# EAGLE design QMUAV Avionics PCB (EAGLE 9.6.2)
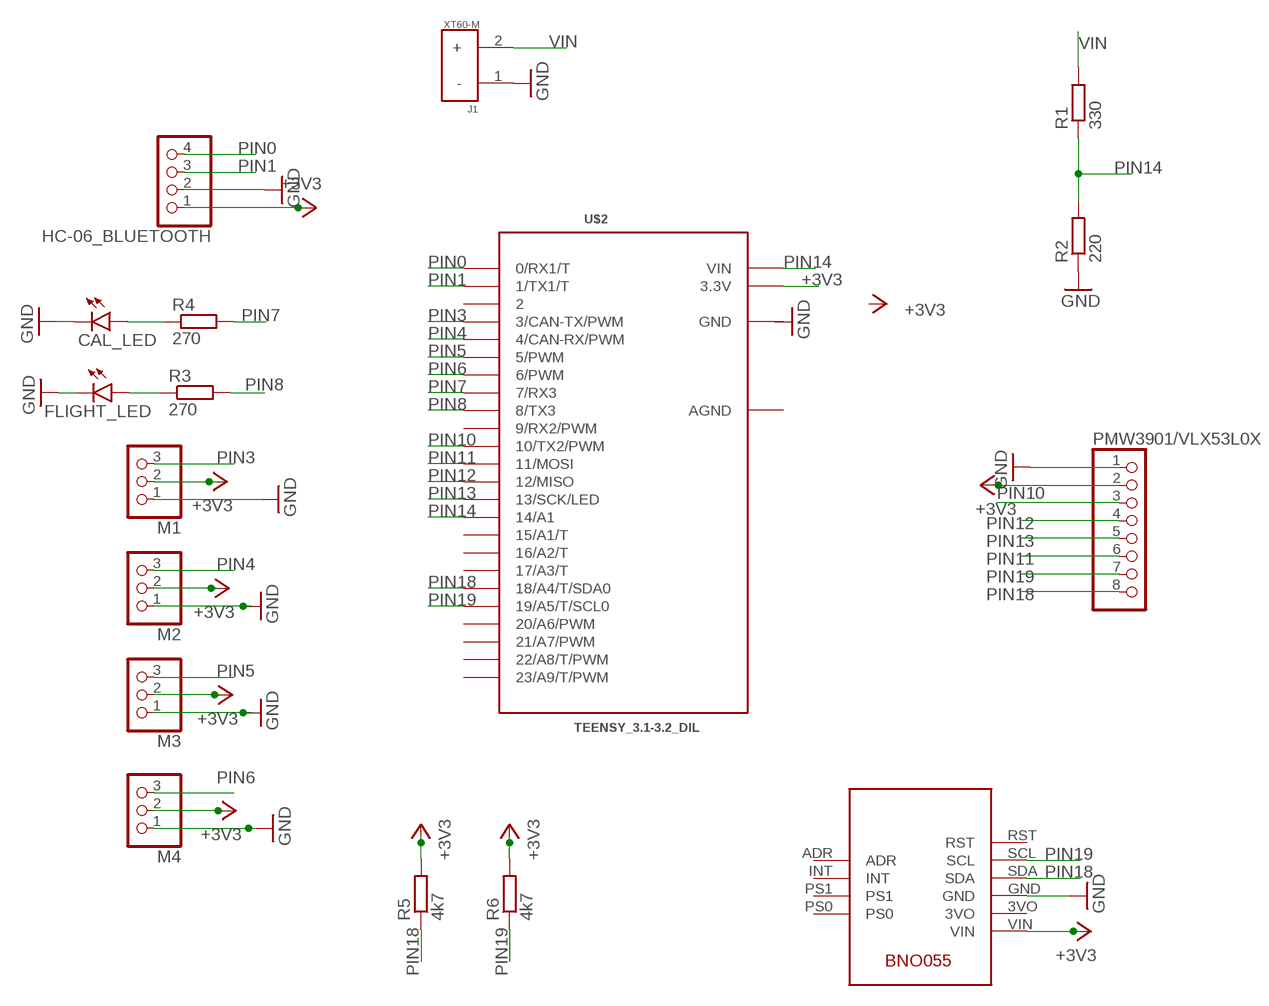
[diagram p0: schematic, sheet 1]

## Parts
CAL_LED  LED5MM  [LED5MM]
FLIGHT_LED  LED5MM  [LED5MM]
HC-06_BLUETOOTH  PINHD-1X4  [1X04]
J1  XT60-M  [AMASS_XT60-M]
M1  PINHD-1X3  [1X03]
M2  PINHD-1X3  [1X03]
M3  PINHD-1X3  [1X03]
M4  PINHD-1X3  [1X03]
PMW3901/VLX53L0X  PINHD-1X8  [1X08]
R1  330  R-EU_0207/10  [0207/10]
R2  220  R-EU_0207/10  [0207/10]
R3  270  R-EU_0207/10  [0207/10]
R4  270  R-EU_0207/10  [0207/10]
R5  4k7  R-EU_0207/10  [0207/10]
R6  4k7  R-EU_0207/10  [0207/10]
U$2  TEENSY_3.1-3.2_DIL  [TEENSY_3.0-3.2&LC_DIL]
U$3  BNO055  [BNO055]

## Nets
+3V3: HC-06_BLUETOOTH.1 M1.2 M2.2 M3.2 M4.2 PMW3901/VLX53L0X.2 R5.2 R6.2 U$2.3.3V U$3.VIN
GND: CAL_LED.K(C) FLIGHT_LED.K(C) HC-06_BLUETOOTH.2 J1.1(-) M1.1 M2.1 M3.1 M4.1 PMW3901/VLX53L0X.1 R2.1 U$3.GND
N$4: CAL_LED.A R4.1
N$5: FLIGHT_LED.A R3.1
PIN0: HC-06_BLUETOOTH.4 U$2.0(0/RX1/T)
PIN1: HC-06_BLUETOOTH.3 U$2.1(1/TX1/T)
PIN3: M1.3 U$2.3(3/CAN-TX/PWM)
PIN4: M2.3 U$2.4(4/CAN-RX/PWM)
PIN5: M3.3 U$2.5(5/PWM)
PIN6: M4.3 U$2.6(6/PWM)
PIN7: R4.2 U$2.7(7/RX3)
PIN8: R3.2 U$2.8(8/TX3)
PIN10: PMW3901/VLX53L0X.3 U$2.10(10/TX2/PWM)
PIN11: PMW3901/VLX53L0X.6 U$2.11(11/MOSI)
PIN12: PMW3901/VLX53L0X.4 U$2.12(12/MISO)
PIN13: PMW3901/VLX53L0X.5 U$2.13(13/SCK/LED)
PIN14: R1.1 R2.2 U$2.14/A0(14/A1) U$2.VIN
PIN18: PMW3901/VLX53L0X.8 R5.1 U$2.18/A4(18/A4/T/SDA0) U$3.SDA
PIN19: PMW3901/VLX53L0X.7 R6.1 U$2.19/A5(19/A5/T/SCL0) U$3.SCL
VIN: J1.2(+) R1.2
Unconnected: U$2.2 U$2.9(9/RX2/PWM) U$2.15/A1(15/A1/T) U$2.16/A2(16/A2/T) U$2.17/A3(17/A3/T) U$2.20/A6(20/A6/PWM) U$2.21/A7(21/A7/PWM) U$2.22/A8(22/A8/T/PWM) U$2.23/A9(23/A9/T/PWM) U$3.3VO U$3.ADR U$3.INT U$3.PS0 U$3.PS1 U$3.RST

## Power pins joined to a net without a drawn wire
AGND: U$2.AGND
GND: U$2.GND

## Library data of the parts
CAL_LED FLIGHT_LED = led:LED: LED OSRAM: - CHIPLED LG R971, LG N971, LY N971, LG Q971, LY Q971, LO R971, LY R971 LH N974, LH R974 LS Q976, LO Q976, LY Q976 LO Q996 - Hyper CHIPLED LW Q18S LB Q993, LB Q99A, LB R99A - SideLED LS A670, LO A670, LY A670, LG A670, LP A670 LB A673, LV A673, LT A673, LW A673 LH A674 LY A675 LS A676, LA A676, LO A676, LY A676, LW A676 LS A679, LY A679, LG A679 - Hyper Micro SIDELED® LS Y876, LA Y876, LO Y876, LY Y876 LT Y87S - SmartLED LW L88C, LW L88S LB L89C, LB L89S, LG L890 LS L89K, LO L89K, LY L89K LS L896, LA L896, LO L896, LY L896 - TOPLED LS T670, LO T670, LY T670, LG T670, LP T670 LSG T670, LSP T670, LSY T670, LOP T670, LYG T670 LG T671, LOG T671, LSG T671 LB T673, LV T673, LT T673, LW T673 LH T674 LS T676, LA T676, LO T676, LY T676, LB T676, LH T676, LSB T676, LW T676 LB T67C, LV T67C, LT T67C, LS T67K, LO T67K, LY T67K, LW E67C LS E67B, LA E67B, LO E67B, LY E67B, LB E67C, LV E67C, LT E67C LW T67C LS T679, LY T679, LG T679 LS T770, LO T770, LY T770, LG T770, LP T770 LB T773, LV T773, LT T773, LW T773 LH T774 LS E675, LA E675, LY E675, LS T675 LS T776, LA T776, LO T776, LY T776, LB T776 LHGB T686 LT T68C, LB T68C - Hyper Mini TOPLED® LB M676 - Mini TOPLED Santana® LG M470 LS M47K, LO M47K, LY M47K Source: http://www.osram.convergy.de LUXEON: - LUMILED® LXK2-PW12-R00, LXK2-PW12-S00, LXK2-PW14-U00, LXK2-PW14-V00 LXK2-PM12-R00, LXK2-PM12-S00, LXK2-PM14-U00 LXK2-PE12-Q00, LXK2-PE12-R00, LXK2-PE12-S00, LXK2-PE14-T00, LXK2-PE14-U00 LXK2-PB12-K00, LXK2-PB12-L00, LXK2-PB12-M00, LXK2-PB14-N00, LXK2-PB14-P00, LXK2-PB14-Q00 LXK2-PR12-L00, LXK2-PR12-M00, LXK2-PR14-Q00, LXK2-PR14-R00 LXK2-PD12-Q00, LXK2-PD12-R00, LXK2-PD12-S00 LXK2-PH12-R00, LXK2-PH12-S00 LXK2-PL12-P00, LXK2-PL12-Q00, LXK2-PL12-R00 Source: www.luxeon.com KINGBRIGHT: KA-3528ASYC Source: www.kingbright.com
HC-06_BLUETOOTH = pinhead:PINHD-1X4: PIN HEADER
J1 = XT60-M:XT60-M: DC supply; XT60; male; PIN:2; for cable; soldered; 60A; 500V; AVAILABILITY: Unavailable; DESCRIPTION: Plug; DC supply; XT60; male; PIN: 2; for cable; soldered; 30A; 500V; MF: AMASS; MP: XT60-M; PACKAGE: Package; PRICE: None
M1-M4 = pinhead:PINHD-1X3: PIN HEADER
PMW3901/VLX53L0X = pinhead:PINHD-1X8: PIN HEADER
R1-R6 = rcl:R-EU_: RESISTOR, European symbol; SPICEPREFIX: R
U$2 = Teensy_3_and_LC_Series_Boards_v1.4:TEENSY_3.1-3.2_DIL: Teensy 3.1 or 3.2 in a DIL Layout.
U$3 = ADAFRUIT BNO055:BNO055

## Board
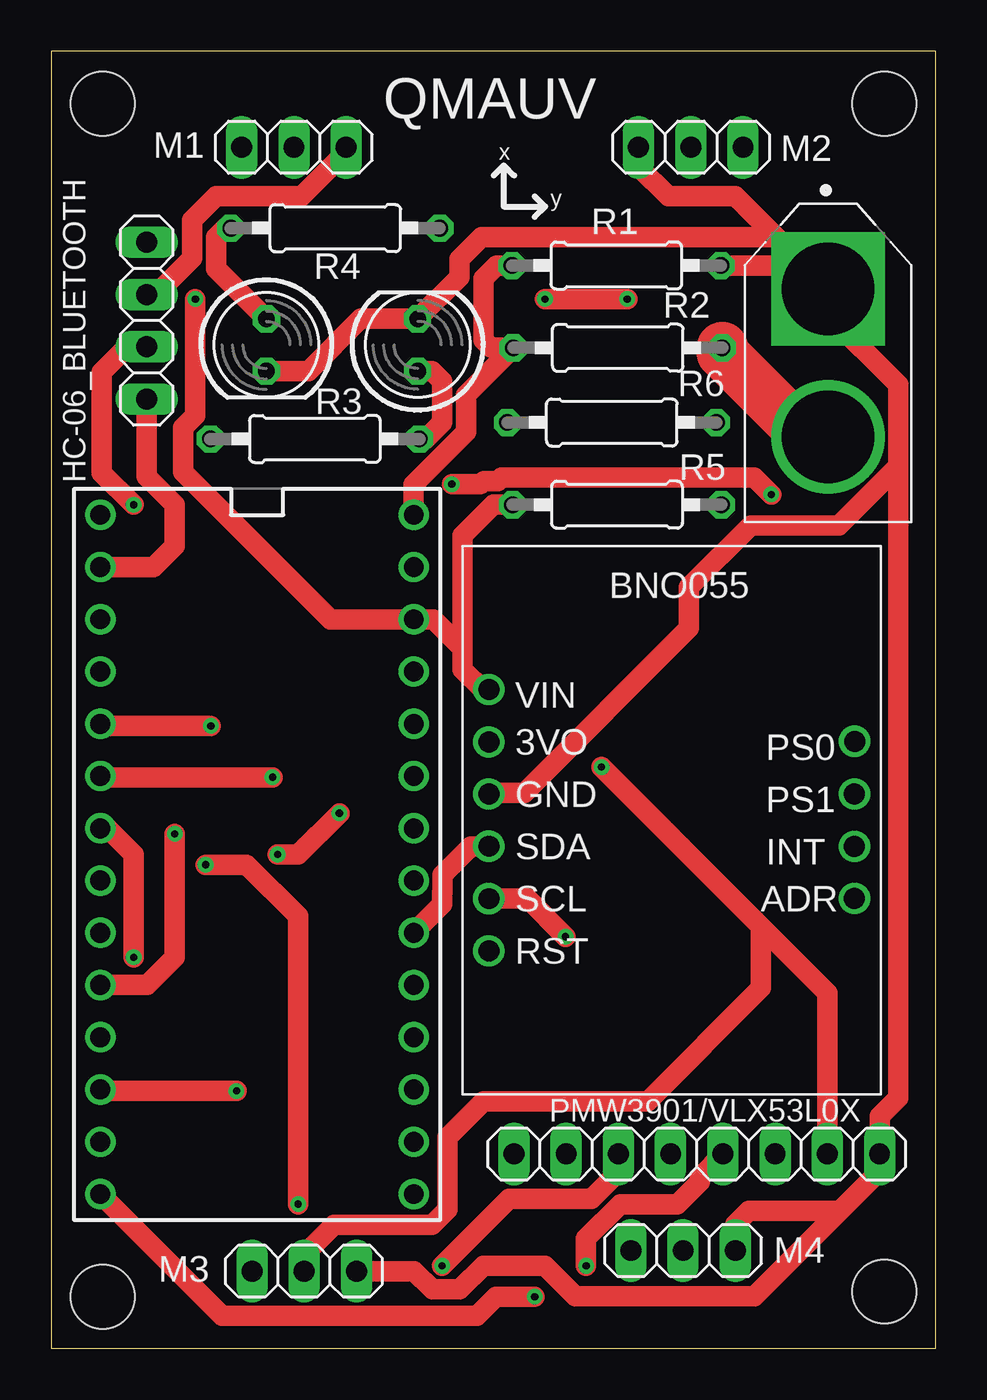
[diagram p1: board, top side]
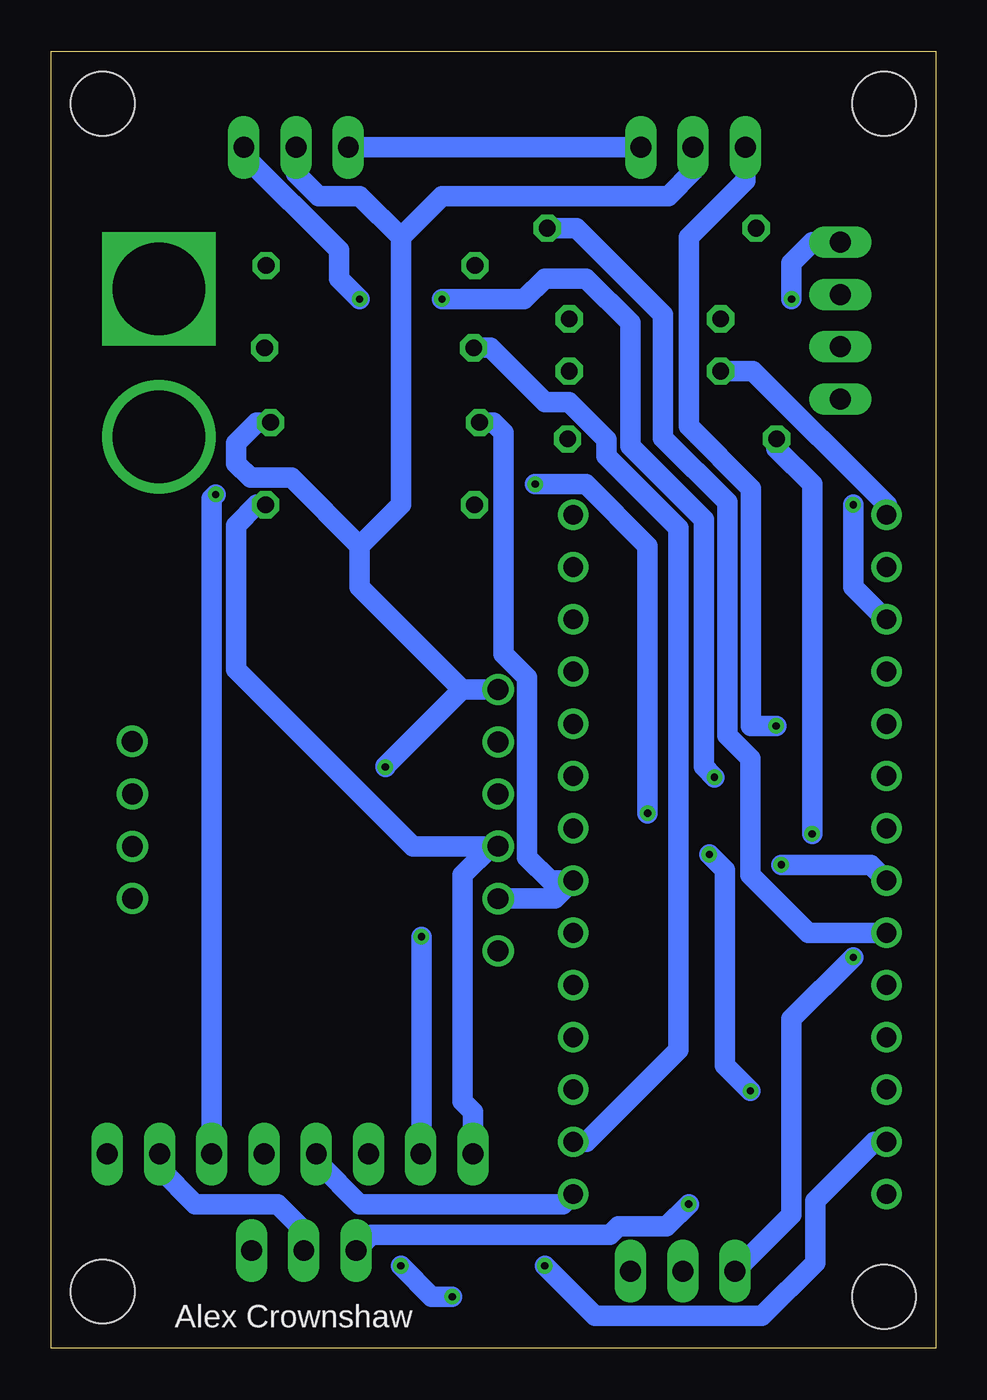
[diagram p2: board, bottom side, seen from below]

Size 42.99 x 63.04 mm. Coordinates in mm from the lower left corner, seen from the top.
Outline: 0,0 42.99,0 42.99,63.04 0,63.04 0,0
Copper layers (1*16): Top 0.035mm / dielectric 1.5mm / Bottom 0.035mm
Design rules "default": minimum track width 6mil, minimum drill 0.35mm, track to track 6mil, track to pad 6mil, pad to pad 6mil, via to via 6mil, smd to smd 6mil, copper to edge 40mil, drill to drill 6mil, minimum pad ring 10mil, minimum via ring 8mil, stop-mask expansion 4mil, vias tented up to drill 0mil, thermal gap 10mil
Holes 3.1 mm at 2.5,2.5 40.5,2.75 2.5,60.5 40.5,60.5

### Footprints (pad centres in the part's own frame; a part is rotated, then mirrored left to right if it is on the bottom)
LED5MM = drill 0.813 octagon: A -1.27,0; K 1.27,0
1X04 = drill 1.016 long: 1 -3.81,0; 2 -1.27,0; 3 1.27,0; 4 3.81,0
AMASS_XT60-M = drill 4.5 square: 1 -3.6,0 | drill 4.5: 2 3.6,0
1X03 = drill 1.016 long: 1 -2.54,0; 2 0,0; 3 2.54,0
1X08 = drill 1.016 long: 1 -8.89,0; 2 -6.35,0; 3 -3.81,0; 4 -1.27,0; 5 1.27,0; 6 3.81,0; 7 6.35,0; 8 8.89,0
0207/10 = drill 0.813 octagon: 1 -5.08,0; 2 5.08,0
TEENSY_3.0-3.2&LC_DIL = drill 0.965: 0 -7.62,13.97; 1 -7.62,11.43; 2 -7.62,8.89; 3 -7.62,6.35; 3.3V 7.62,11.43; 4 -7.62,3.81; 5 -7.62,1.27; 6 -7.62,-1.27; 7 -7.62,-3.81; 8 -7.62,-6.35; 9 -7.62,-8.89; 10 -7.62,-11.43; 11 -7.62,-13.97; 12 -7.62,-16.51; 13 7.62,-16.51; 14/A0 7.62,-13.97; 15/A1 7.62,-11.43; 16/A2 7.62,-8.89; 17/A3 7.62,-6.35; 18/A4 7.62,-3.81; 19/A5 7.62,-1.27; 20/A6 7.62,1.27; 21/A7 7.62,3.81; 22/A8 7.62,6.35; 23/A9 7.62,8.89; AGND 7.62,13.97; GND -7.62,16.51; VIN 7.62,16.51
BNO055 = drill 1.016: 3VO 9.53,1.27; ADR 17.14,19.05; GND 12.06,1.27; INT 14.61,19.05; PS0 9.5,19.06; PS1 12.06,19.05; RST 19.69,1.27; SCL 17.15,1.27; SDA 14.6,1.27; VIN 6.98,1.27

### Placement (x,y rotation side)
CAL_LED  10.45,48.77 270 top
FLIGHT_LED  17.81,48.77 90 top
HC-06_BLUETOOTH  4.63,49.95 270 top
J1  37.76,47.9 270 top
M1  11.79,58.38 180 top
M2  31.09,58.38 0 top
M3  12.29,3.74 180 top
M4  30.72,4.74 180 top
PMW3901/VLX53L0X  31.38,9.44 180 top
R1  27.54,48.63 0 top
R2  27.47,52.63 180 top
R3  12.81,44.2 180 top
R4  13.8,54.45 0 top
R5  27.5,41 180 top
R6  27.25,45 0 top
U$2  10,24 0 top
U$3  20,39 270 top

### Tracks (layer width: path | path; a pad name or v marks a point on that pad's centre or on a via)
+3V3  (via drill 0.35)
  Top 1: v7,51 7,45.33 6.42,44.74 6.42,42.58 13.57,35.43 U$2.3.3V 18.57,35.43 20,34 | v26.75,28.25 34.5,20.5 | 34.5,20.5 37.73,17.27 PMW3901/VLX53L0X.2 | 34.5,20.5 34.5,17.5 29,12 21,12 19.25,10.25 19.25,6.75 18.5,6 13.75,6 12.29,4.54 M3.2 | R5.2 21.5,41 20,39.5 20,34 | 20,34 20,33 20.98,32.02 U$3.VIN
  Bottom 1: HC-06_BLUETOOTH.1 5.99,53.76 7,52.75 v7,51 | U$3.VIN 23.02,32.02 | 23.02,32.02 28,37 28,39 | 28,39 26,41 26,54 | 26,54 24,56 13,56 11.79,57.21 M1.2 | 26,54 28,56 30,56 31.09,57.09 M2.2 | 28,39 31.31,42.31 33.31,42.31 34,43 34,44 33,45 R6.2 | 23.02,32.02 26.75,28.29 v26.75,28.25 | PMW3901/VLX53L0X.2 37.73,8.73 36,7 32,7 30.72,5.72 M4.2
GND
  Top 1: R2.1 36.62,52.63 | 36.62,52.63 J1.1 | J1.1 37.76,50.24 41.17,46.83 41.17,42.88 | 36.62,52.63 35.25,54 20.9,54 19.85,52.94 19.85,52.08 FLIGHT_LED.K 15.04,50.04 12.5,47.5 CAL_LED.K | M2.1 28.55,57.45 30,56 33.25,56 J1.1 | M1.1 14.33,58.16 12.17,56 8,56 6.85,54.85 6.85,53 5.07,51.22 HC-06_BLUETOOTH.2 | 41.17,42.88 41.17,12.17 40.27,11.27 PMW3901/VLX53L0X.1 40.27,8.61 38.33,6.67 | 38.33,6.67 34.18,2.52 25.48,2.52 24,4 21,4 19.85,2.85 18.52,2.85 17.63,3.74 M3.1 | 38.33,6.67 33.92,6.67 33.26,6.01 M4.1 | U$3.GND 21.33,27 23,27 31,35 31,37 34,40 38.28,40 41.17,42.88
  Bottom 1: M1.1 M2.1 | U$2.GND 2.38,41.01 8.87,47.5 CAL_LED.K
N$4
  Top 1: R4.1 8.45,54.45 8,54 8,52.49 CAL_LED.A
N$5
  Top 1: R3.1 18.2,44.2 19,45 19,47 18.5,47.5 FLIGHT_LED.A
PIN0
  Top 1: HC-06_BLUETOOTH.4 4.63,42.37 6,41 6,39 4.97,37.97 U$2.0
PIN1  (via drill 0.35)
  Top 1: HC-06_BLUETOOTH.3 3.68,48.68 2.45,47.45 2.45,42.55 v4,41
  Bottom 1: U$2.1 2.43,35.43 4,37 v4,41
PIN3  (via drill 0.35)
  Top 1: v7.75,30.25 2.48,30.25 U$2.3
  Bottom 1: M1.3 9.25,56.75 12,54 12,44.83 8.97,41.8 8.97,30.25 v7.75,30.25
PIN4  (via drill 0.35)
  Top 1: v28,51 v24,51 | v10.75,27.75 2.44,27.75 U$2.4
  Bottom 1: v28,51 29,52 29,53.37 33.63,58 M2.3 | v24,51 20,51 19,52 17,52 14.85,49.85 14.85,43.85 11.27,40.27 11.27,28.27 v10.75,27.75
PIN5  (via drill 0.35)
  Top 1: v4,19 4,24 2.73,25.27 U$2.5
  Bottom 1: M3.3 7,6.49 7,16 v4,19
PIN6  (via drill 0.35)
  Top 1: v7.5,23.5 9.5,23.5 12,21 v12,7
  Bottom 1: v12,7 13.08,5.92 15.42,5.92 15.83,5.5 27.42,5.5 M4.3 | v7.5,23.5 3.15,23.5 U$2.6
PIN7
  Bottom 1: R4.2 17.45,54.45 13.25,50.25 13.25,44.25 10.12,41.12 10.12,29.77 9,28.65 9,23 6.19,20.19 U$2.7
PIN8  (via drill 0.35)
  Top 1: v6,25 6,19 4.65,17.65 U$2.8
  Bottom 1: R3.2 7.73,43.73 6,42 v6,25
PIN10  (via drill 0.35)
  Top 1: v35,41.5 34.19,42.31 21.88,42.31 21.72,42.15 21.02,42.15 20.87,42 v19.47,42 | v14,26 12,24 v11,24 | v9,12.5 2.45,12.5 U$2.10
  Bottom 1: PMW3901/VLX53L0X.3 35.19,41.31 v35,41.5 | v19.47,42 17,42 14,39 v14,26 | v11,24 10.25,23.25 10.25,13.75 v9,12.5
PIN11  (via drill 0.35)
  Top 1: PMW3901/VLX53L0X.6 27.57,8.57 26.25,7.25 22.25,7.25 v19,4
  Bottom 1: v19,4 16.56,1.56 8.44,1.56 5.85,4.15 5.85,7.15 2.97,10.03 U$2.11
PIN12  (via drill 0.35)
  Top 1: PMW3901/VLX53L0X.4 31.52,8.31 31.52,8.09 30.43,7 27.67,7 26,5.33 v26,4 | v23.5,2.5 21.63,2.5 20.69,1.56 8.31,1.56 U$2.12
  Bottom 1: v26,4 24.5,2.5 v23.5,2.5
PIN13
  Bottom 1: PMW3901/VLX53L0X.5 30,9.33 30,9 28,7 18.11,7 U$2.13
PIN14
  Top 1: R2.2 21.63,52.63 21,52 21,49 21.37,48.63 R1.1 20.15,46.32 20.15,44.52 17.62,41.99 U$2.VIN
  Bottom 1: R1.1 21.63,48.63 19,46 17.83,46 16,44.17 16,43.37 12.5,39.87 12.5,14.5 16.97,10.03 U$2.14/A0
PIN18
  Top 1: U$2.18/A4 19,21.57 19,22.15 19.01,22.16 19.01,23.01 20.4,24.4 U$3.SDA
  Bottom 1: PMW3901/VLX53L0X.8 22.49,11.49 23,12 23,23 21.6,24.4 | 21.6,24.4 U$3.SDA | R5.1 33,41 34,40 34,33 25.4,24.4 21.6,24.4
PIN19  (via drill 0.35)
  Top 1: v25,20 23.15,21.85 U$3.SCL
  Bottom 1: PMW3901/VLX53L0X.7 25,9.47 v25,20 | R6.1 21.5,45 21,44.5 21,33.75 19.86,32.61 19.86,23.86 18.73,22.73 U$2.19/A5 18.5,21.85 U$3.SCL
VIN
  Top 2.5: J1.2 36.7,44.3 32.62,48.38 R1.2

### Text on the board
tNames: QMAUV | x | y
bNames: Alex Crownshaw